# Altium project LHCbit.PrjPcb
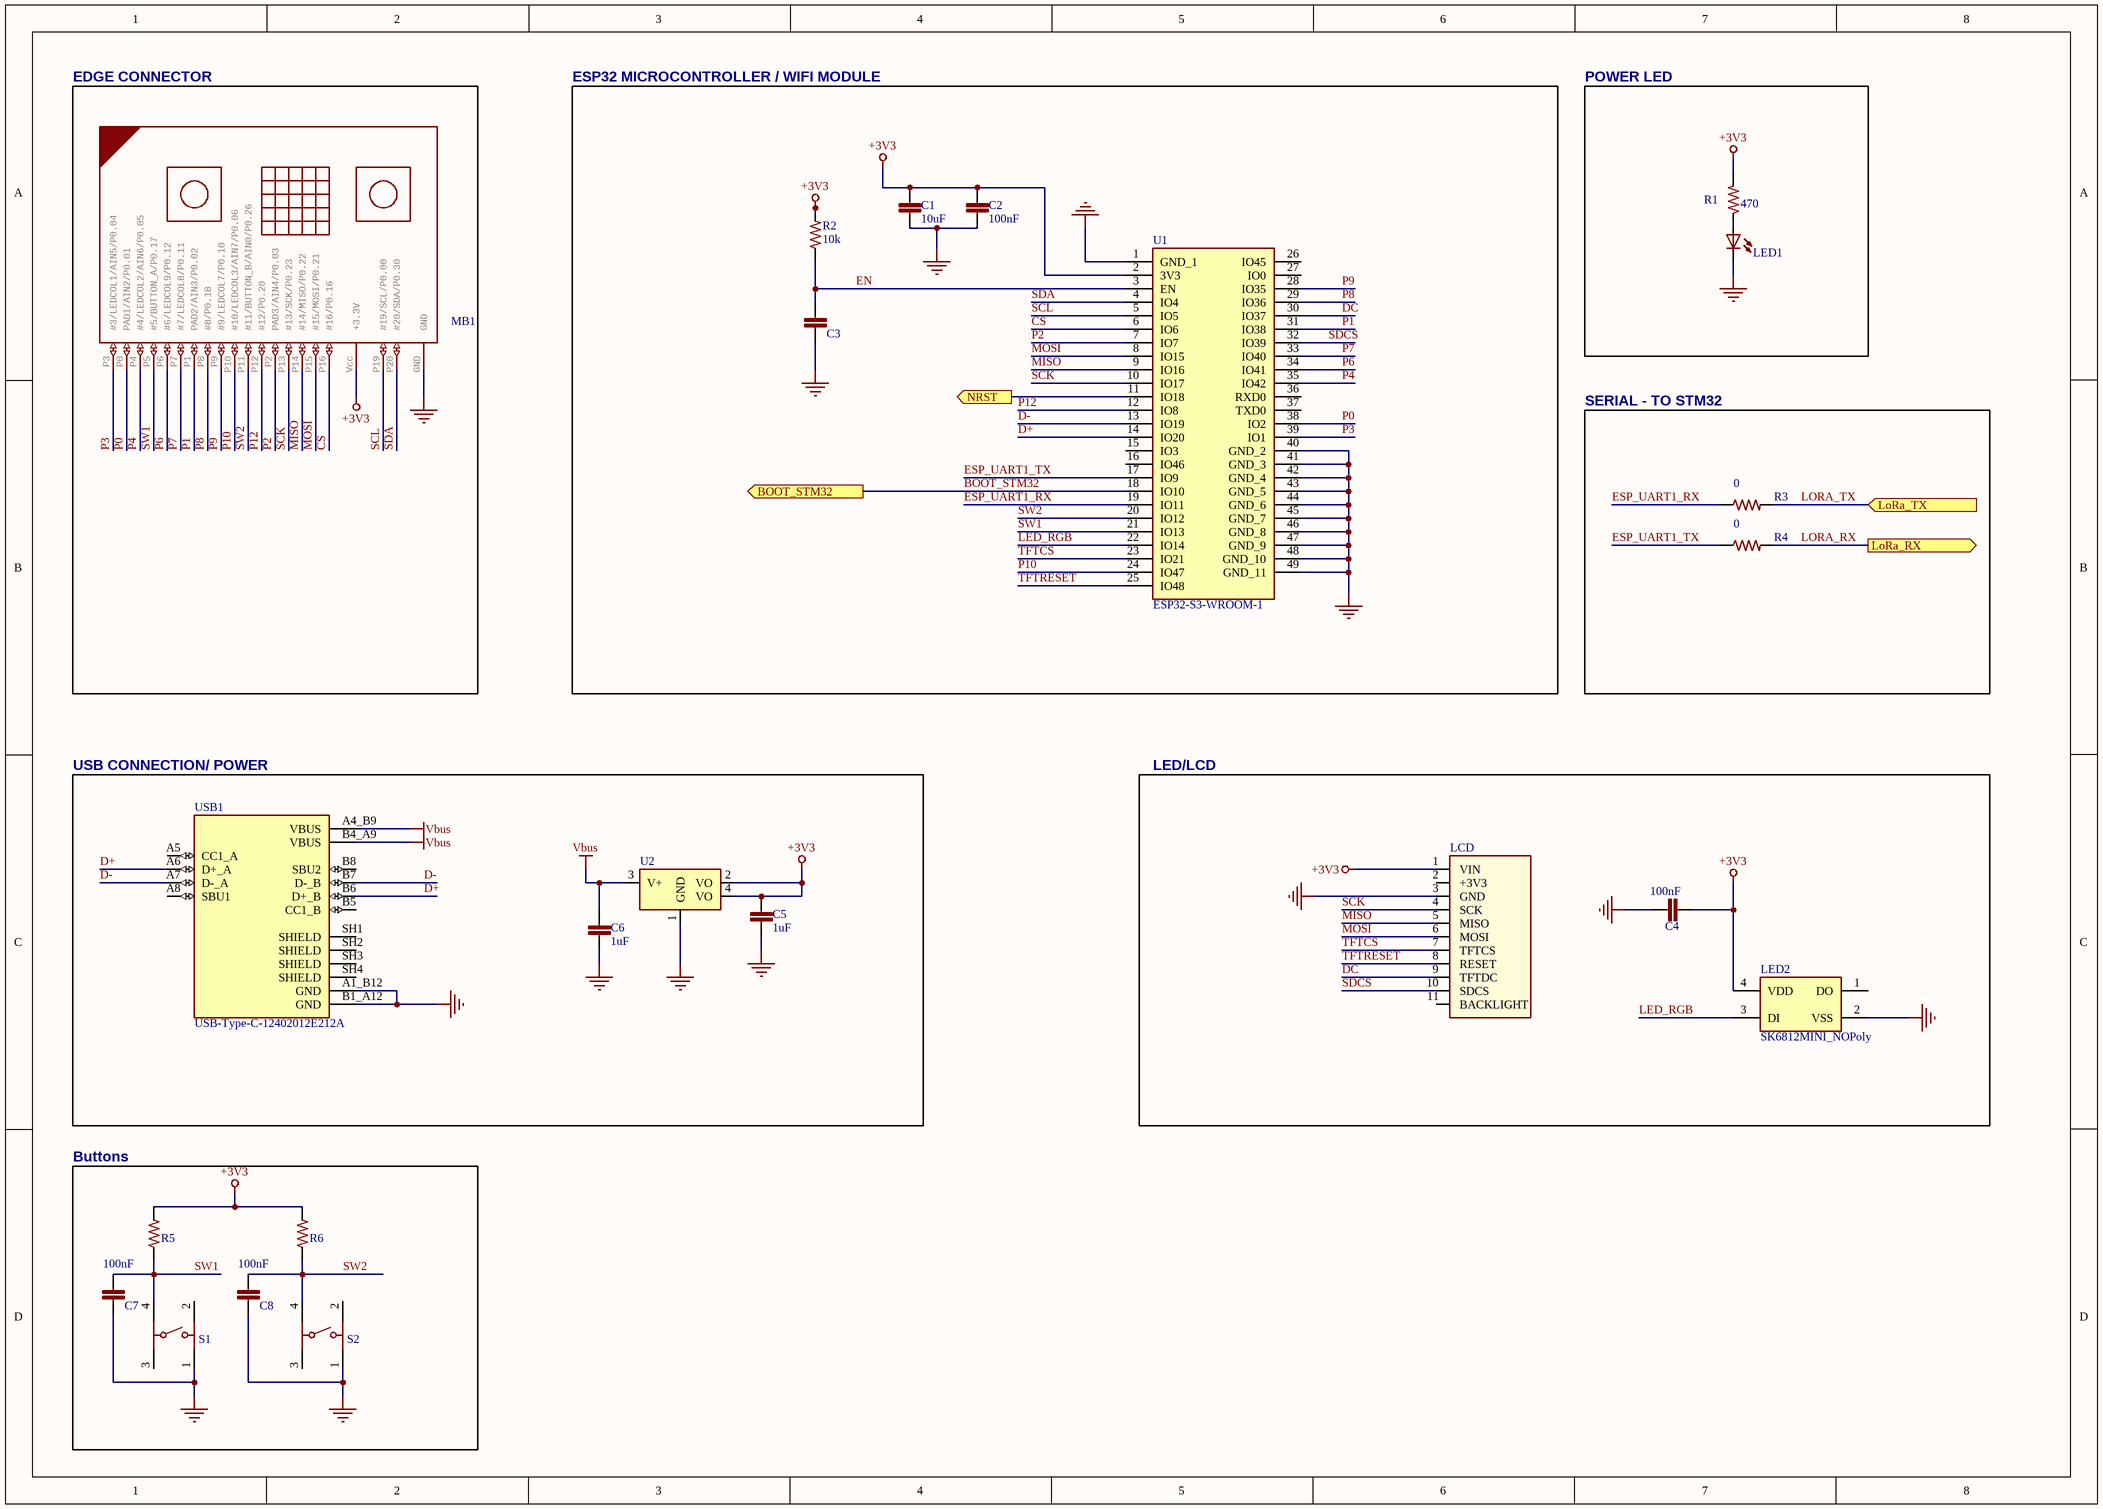
[diagram p0: ESP32_LHCbit.SchDoc]
<SheetTotal>: 2; <Revision>: 1.0; <ProjectName>: LHCbit; <Author>: Leandro Pereira / Thiago Roque/Gustavo
2 sheets, 50 parts. Net scope: flat (ports and power ports of the same name join across sheets).
Board file: LHCbit.PcbDoc
Sheets:
  ESP32_LHCbit.SchDoc
  STM32WL_LHCbit.SchDoc

## Sheet ESP32_LHCbit.SchDoc
size A3; SheetNumber: 1

### Parts
C1  value 10uF  [C0603]  (hidden comment: C-EUC0603)
C2  value 100nF  [C0603]  (hidden comment: C-EUC0603)
C3  C-EUC0402  [C0402]  (value not drawn)
C4  value 100nF  [C0402]  (hidden comment: C-EUC0402)
C5  value 1uF  [C0603]  (hidden comment: C-EUC0603)
C6  value 1uF  [C0603]  (hidden comment: C-EUC0603)
C7  value 100nF  [C0402]  (hidden comment: C-EUC0402)
C8  value 100nF  [C0402]  (hidden comment: C-EUC0402)
LCD  Adafruit 0.96"  TFT LCD  [ADafruit 0.96 Display]  (value not drawn)
LED1  (no value)  [CHIPLED_0805]
LED2  SK6812MINI_NOPoly  [WS2812BMINI_no_poly]
MB1  MICRO:BIT_EDGE  [MICROBIT_EDGE]  (value not drawn)  (no BOM)
R1  value 470  [R0603]  (hidden comment: R-US_R0603)
R2  value 10k  [R0402]  (hidden comment: R-US_R0402)
R3  value 0  [R0402]  (hidden comment: R-US_R0402)
R4  value 0  [R0402]  (hidden comment: R-US_R0402)
R5  R-US_R0402  [R0402]  (value not drawn)
R6  R-US_R0402  [R0402]  (value not drawn)
S1  DTSM-6  [4301x20438x6_6x6x4.3_DTSM-6]  (value not drawn)
S2  DTSM-6  [4301x20438x6_6x6x4.3_DTSM-6]  (value not drawn)
U1  ESP32-S3-WROOM-1  [ESP32S3WROOM1N16R2]
U2  NCP1117LP  [SOT223]  (value not drawn)
USB1  USB-Type-C-12402012E212A  [AMPHENOL_12402012E212A]

### Blocks framed on the sheet
EDGE CONNECTOR: MB1
ESP32 MICROCONTROLLER / WIFI MODULE: C1-C3 R2 U1
POWER LED: LED1 R1
SERIAL - TO STM32: R3 R4
USB CONNECTION/ POWER: C5 C6 U2 USB1
LED/LCD: C4 LCD LED2
Buttons: C7 C8 R5 R6 S1 S2

### Ports
BOOT_STM32 (out), LoRa_RX (out), LoRa_TX (in), NRST (out)

### Nets
+3V3: C1.1 C2.1 C4.2 C5.1 LCD.1(VIN) LED2.4(VDD) MB1.Vcc(+3.3V) R1.2 R2.2 R5.2 R6.2 U1.2(3V3) U2.2(VO) U2.4(VO)  [project net VBAT]
GND: C1.2 C2.2 C3.2 C4.1 C5.2 C6.2 C7.2 C8.2 LCD.3(GND) LED1.C LED2.2(VSS) MB1.GND S1.1 S2.1 U1.1(GND_1) U1.40(GND_2) U1.41(GND_3) U1.42(GND_4) U1.43(GND_5) U1.44(GND_6) U1.45(GND_7) U1.46(GND_8) U1.47(GND_9) U1.48(GND_10) U1.49(GND_11) U2.1(GND) USB1.A1_B12(GND) USB1.B1_A12(GND)
Vbus: C6.1 U2.3(V+) USB1.A4_B9(VBUS) USB1.B4_A9(VBUS)
BOOT_STM32: U1.18(IO10) ; port BOOT_STM32
CS: MB1.P16(#16/P0.16) U1.6(IO6)
D+: U1.14(IO20) USB1.A6(D+_A) USB1.B6(D+_B)
D-: U1.13(IO19) USB1.A7(D-_A) USB1.B7(D-_B)
DC: LCD.9(TFTDC) U1.30(IO37)
EN: C3.1 R2.1 U1.3(EN)
ESP_UART1_RX: R3.1 U1.19(IO11)
ESP_UART1_TX: R4.1 U1.17(IO9)
LED_RGB: LED2.3(DI) U1.22(IO14)
LORA_RX: R4.2 ; port LoRa_RX
LORA_TX: R3.2 ; port LoRa_TX
MISO: LCD.5(MISO) MB1.P14(#14/MISO/P0.22) U1.9(IO16)
MOSI: LCD.6(MOSI) MB1.P15(#15/MOSI/P0.21) U1.8(IO15)
P0: MB1.P0(PAD1/AIN2/P0.01) U1.38(IO2)
P1: MB1.P1(PAD2/AIN3/P0.02) U1.31(IO38)
P2: MB1.P2(PAD3/AIN4/P0.03) U1.7(IO7)
P3: MB1.P3(#3/LEDCOL1/AIN5/P0.04) U1.39(IO1)
P4: MB1.P4(#4/LEDCOL2/AIN6/P0.05) U1.35(IO42)
P6: MB1.P6(#6/LEDCOL9/P0.12) U1.34(IO41)
P7: MB1.P7(#7/LEDCOL8/P0.11) U1.33(IO40)
P8: MB1.P8(#8/P0.18) U1.29(IO36)
P9: MB1.P9(#9/LEDCOL7/P0.10) U1.28(IO35)
P10: MB1.P10(#10/LEDCOL3/AIN7/P0.06) U1.24(IO47)
P12: MB1.P12(#12/P0.20) U1.12(IO8)
SCK: LCD.4(SCK) MB1.P13(#13/SCK/P0.23) U1.10(IO17)
SCL: MB1.P19(#19/SCL/P0.00) U1.5(IO5)
SDA: MB1.P20(#20/SDA/P0.30) U1.4(IO4)
SDCS: LCD.10(SDCS) U1.32(IO39)
SW1: C7.1 MB1.P5(#5/BUTTON_A/P0.17) R5.1 S1.4 U1.21(IO13)
SW2: C8.1 MB1.P11(#11/BUTTON_B/AIN0/P0.26) R6.1 S2.4 U1.20(IO12)
TFTCS: LCD.7(TFTCS) U1.23(IO21)
TFTRESET: LCD.8(RESET) U1.25(IO48)
NetC18_1: U1.11(IO18) ; port NRST
NetLED1_A: LED1.A R1.1

Not connected (* = marked no-connect by the designer): LCD 2(+3V3) 11(BACKLIGHT); LED2 1(DO); S1 2 3; S2 2 3; U1 15(IO3) 16(IO46) 26(IO45) 27(IO0) 36(RXD0) 37(TXD0); USB1 A5(CC1_A) A8(SBU1) B5(CC1_B) B8(SBU2) SH1(SHIELD) SH2(SHIELD) SH3(SHIELD) SH4(SHIELD)

### Library data of the parts
C1 = C-EUC0603: Part Number: CL10A106KP8NNNC; Vendor: Samsung; Família: Capacitor
C2 = C-EUC0603: Part Number: CC0603KRX7R9BB104; Vendor: YAGEO; Família: Capacitor
C3 = C-EUC0402: Part Number: C0402C104K8; Value: 100nF; Vendor: KEMET; Família: Capacitor
C4 C7 C8 = C-EUC0402: Part Number: C0402C104K8; Vendor: KEMET; Família: Capacitor
C5 C6 = C-EUC0603: Part Number: CL10A105KO8NNNC; Vendor: Samsung; Família: Capacitor
LED1 = LEDCHIPLED_0805: Part Number: AP2012EC; Vendor: Kingbright; Família: LED
LED2 = SK6812MINI_NOPoly: SMD RGB (WS2812/SK6812MINI) 3535; Família: LED; Vendor: *; Value: *; Part Number: SK6812MINI
R1 = R-US_R0603: Part Number: RC0603FR-07470RL; Vendor: Yageo
R2 = R-US_R0402: Part Number: RC0402FR-0710KL; Vendor: YAGEO; Família: Resistor
R3 R4 = R-US_R0402: Part Number: PA0402-R-070RL; Vendor: YAGEO; Família: Resistor
R5 R6 = R-US_R0402: Part Number: RC0402FR-0710KL; Value: 10k; Vendor: YAGEO; Família: Resistor
S1 S2 = DTSM-6: WS-TASV 6x6mm Tact Switch, SMD version; Vendor: Wurth Elektronik; Família: Switches; Part Number: DTSM-6
U1 = ESP32-S3-WROOM-1: Integrated Circuit; Part Number: ESP32-S3-WROOM-1-N16R2; Vendor: Espressif; Família: IC
U2 = NCP1117LP: Part Number: TLV1117LV33DCYR; Vendor: Texas Instruments
USB1 = USB-Type-C-12402012E212A: USB2.0, Type C; Part Number: TYPEC-304-ACP16; Família: Connector; Vendor: XUNPU; Value: *

## Sheet STM32WL_LHCbit.SchDoc: Prototipo Medidor Sem Fio
size A3; SheetNumber: 3
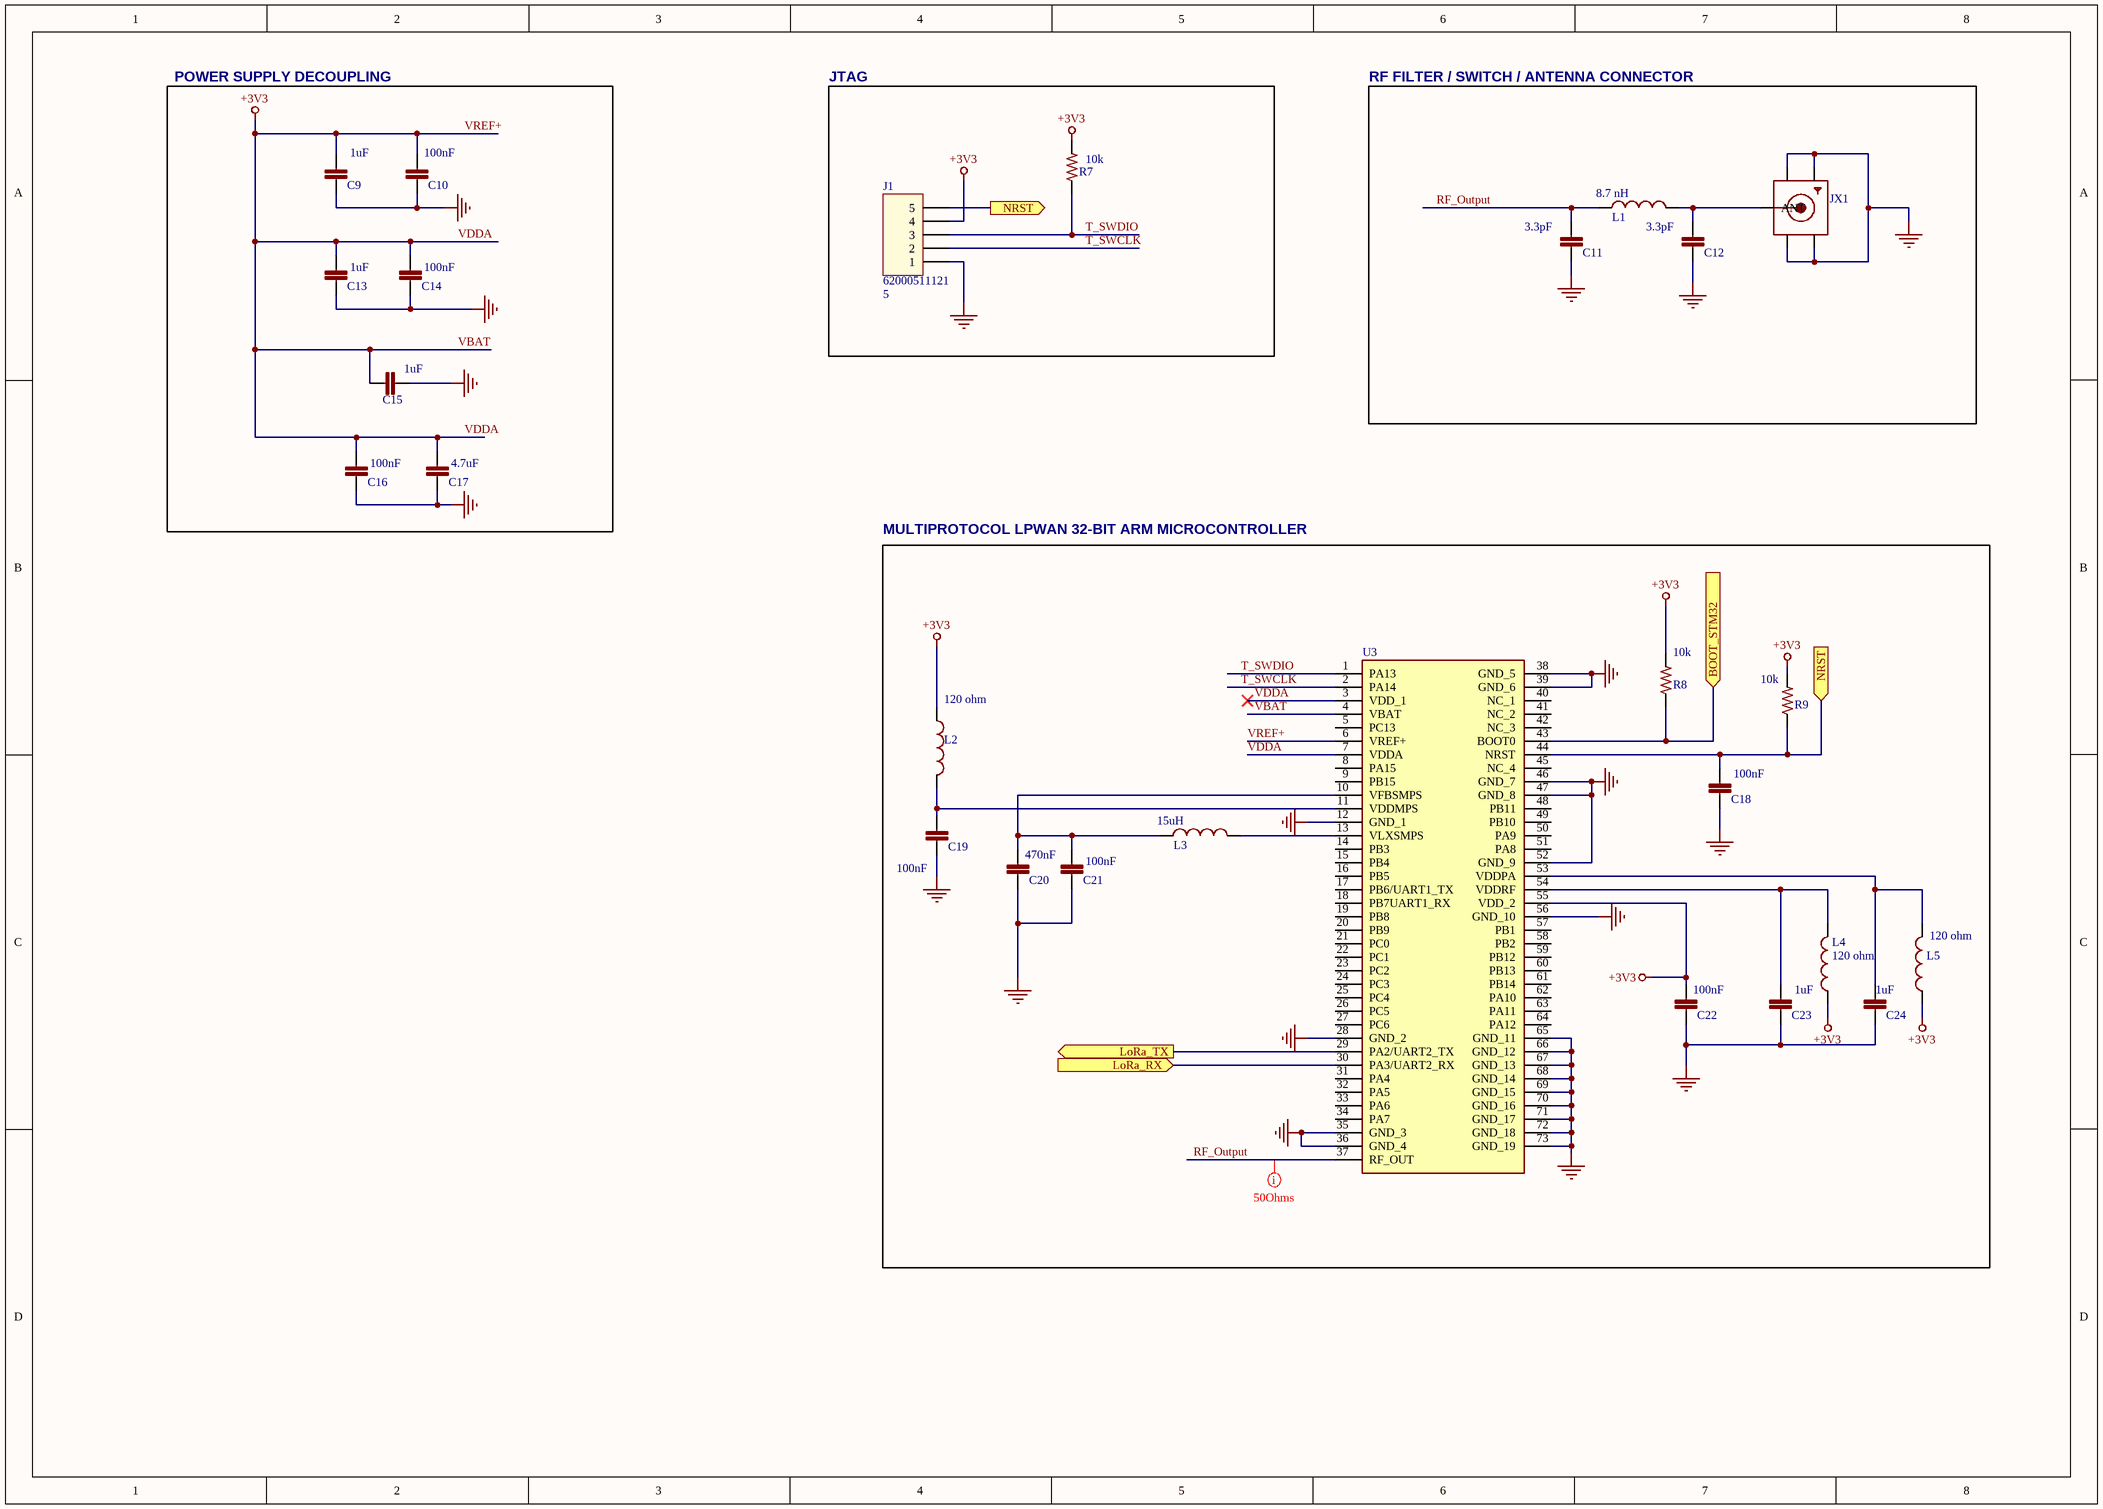
[diagram p1: STM32WL_LHCbit.SchDoc]

### Parts
C9  value 1uF  [C0402]  (hidden comment: C-EUC0402)
C10  value 100nF  [C0402]  (hidden comment: C-EUC0402)
C11  value 3.3pF  [C0402]  (hidden comment: C-EUC0402)  (no BOM)
C12  value 3.3pF  [C0402]  (hidden comment: C-EUC0402)  (no BOM)
C13  value 1uF  [C0402]  (hidden comment: C-EUC0402)
C14  value 100nF  [C0402]  (hidden comment: C-EUC0402)
C15  value 1uF  [C0402]  (hidden comment: C-EUC0402)
C16  value 100nF  [C0402]  (hidden comment: C-EUC0402)
C17  value 4.7uF  [C0402]  (hidden comment: C-EUC0402)
C18  value 100nF  [C0402]  (hidden comment: C-EUC0402)
C19  value 100nF  [C0402]  (hidden comment: C-EUC0402)
C20  value 470nF  [C0402]  (hidden comment: C-EUC0402)
C21  value 100nF  [C0402]  (hidden comment: C-EUC0402)
C22  value 100nF  [C0402]  (hidden comment: C-EUC0402)
C23  value 1uF  [C0402]  (hidden comment: C-EUC0402)
C24  value 1uF  [C0402]  (hidden comment: C-EUC0402)
J1  62000511121  value 5  [62000511121]  (no BOM)
JX1  SMACONNECTOR_EDGE_UFL  [SMA_EDGELAUNCH_UFL]  (value not drawn)
L1  value 8.7 nH  [L0402 - rounded]  (hidden comment: Ferrite bead 0402)
L2  value 120 ohm  [L0603]  (hidden comment: Ferrite bead 0603)
L3  value 15uH  [L0805]
L4  value 120 ohm  [L0603]  (hidden comment: Ferrite bead 0603)
L5  value 120 ohm  [L0603]  (hidden comment: Ferrite bead 0603)
R7  value 10k  [R0402]  (hidden comment: R-US_R0402)
R8  value 10k  [R0402]  (hidden comment: R-US_R0402)
R9  value 10k  [R0402]  (hidden comment: R-US_R0402)
U3  RAK3172-SiP  [RAK3172SiP]  (value not drawn)

### Blocks framed on the sheet
POWER SUPPLY DECOUPLING: C9 C10 C13-C17
JTAG: J1 R7
RF FILTER / SWITCH / ANTENNA CONNECTOR: C11 C12 JX1 L1
MULTIPROTOCOL LPWAN 32-BIT ARM MICROCONTROLLER: C18-C24 L2-L5 R8 R9 U3

### Ports
BOOT_STM32 (in), LoRa_RX (in), LoRa_TX (out), NRST (in), NRST (out)

### Nets
GND: C9.2 C10.2 C11.1 C12.1 C13.2 C14.2 C15.2 C16.2 C17.2 C18.2 C19.2 C20.2 C21.2 C22.2 C23.2 C24.2 J1.1 JX1.GND@1(GND1) JX1.GND@2(GND2) JX1.GND@3(GND3) JX1.GND@4(GND4) U3.12(GND_1) U3.28(GND_2) U3.35(GND_3) U3.36(GND_4) U3.38(GND_5) U3.39(GND_6) U3.46(GND_7) U3.47(GND_8) U3.52(GND_9) U3.56(GND_10) U3.65(GND_11) U3.66(GND_12) U3.67(GND_13) U3.68(GND_14) U3.69(GND_15) U3.70(GND_16) U3.71(GND_17) U3.72(GND_18) U3.73(GND_19)
VBAT: C9.1 C10.1 C13.1 C14.1 C15.1 C16.1 C17.1 C22.1 J1.4 L2.1 L4.1 L5.1 R7.2 R8.2 R9.2 U3.3(VDD_1) U3.4(VBAT) U3.6(VREF+) U3.7(VDDA) U3.55(VDD_2)  [also labelled +3V3, VDDA, VREF+]
BOOT_STM32: R8.1 U3.43(BOOT0) ; port BOOT_STM32
LORA_RX: U3.30(PA3/UART2_RX) ; port LoRa_RX
LORA_TX: U3.29(PA2/UART2_TX) ; port LoRa_TX
RF_Output: C11.2 L1.1 U3.37(RF_OUT)
T_SWCLK: J1.2 U3.2(PA14)
T_SWDIO: J1.3 R7.1 U3.1(PA13)
NetC12_2: C12.2 JX1.P(ANT) L1.2
NetC18_1: C18.1 J1.5 R9.1 U3.44(NRST) ; port NRST
NetC19_1: C19.1 L2.2 U3.11(VDDMPS)
NetC20_1: C20.1 C21.1 L3.1 U3.10(VFBSMPS)
NetC23_1: C23.1 L4.2 U3.54(VDDRF)
NetC24_1: C24.1 L5.2 U3.53(VDDPA)
NetL3_2: L3.2 U3.13(VLXSMPS)

Not connected (* = marked no-connect by the designer): U3 5(PC13) 8(PA15) 9(PB15) 14(PB3) 15(PB4) 16(PB5) 17(PB6/UART1_TX) 18(PB7UART1_RX) 19(PB8) 20(PB9) 21(PC0) 22(PC1) 23(PC2) 24(PC3) 25(PC4) 26(PC5) 27(PC6) 31(PA4) 32(PA5) 33(PA6) 34(PA7) 40(NC_1) 41(NC_2) 42(NC_3) 45(NC_4) 48(PB11) 49(PB10) 50(PA9) 51(PA8) 57(PB1) 58(PB2) 59(PB12) 60(PB13) 61(PB14) 62(PA10) 63(PA11) 64(PA12)

### Layout directives
net class 50Ohms: RF_Output

### Library data of the parts
C9 C13 C15 C23 C24 = C-EUC0402: Part Number: CL05A105KA5NQNC; Vendor: Samsung; Família: Capacitor
C10 C14 C16 C18 C19 C21 C22 = C-EUC0402: as C4 on sheet ESP32_LHCbit
C11 C12 = C-EUC0402: Part Number: GRM1555C1H3R3WA01D; Vendor: Murata; Família: Capacitor
C17 = C-EUC0402: Part Number: CL05A475MQ5NRNC; Vendor: Samsung; Família: Capacitor
C20 = C-EUC0402: Part Number: GRM155R61H474KE11D; Vendor: Murata; Família: Capacitor
J1 = 62000511121: WR-PHD 2.00 mm THT Pin Header, 6p; Vendor: Wurth Elektronik; Família: Connector; Part Number: 62000511121
JX1 = SMACONNECTOR_EDGE_UFL: Part Number: SMA-J-P-H-ST-EM1; Vendor: SAMTECH; Família: Connector
L1 = L-US0402: Part Number: LQW15AN8N7G00D; Vendor: Murata; Família: Inductor
L2 L4 L5 = L-US0603: Part Number: YI160808U121-2R5T; Vendor: YJYCOIN; Família: Inductor
L3 = L-US0805: Part Number: MLZ2012M150WTD25; Vendor: TDK; Família: Inductor
R7-R9 = R-US_R0402: as R2 on sheet ESP32_LHCbit
U3 = RAK3172-SiP: Integrated Circuit; Part Number: RAK3172-SIP-9-SM-NI; Família: IC; Vendor: RAK

## Nets that join several sheets
GND: ESP32_LHCbit (28 pins), STM32WL_LHCbit (40 pins)
VBAT: ESP32_LHCbit (14 pins), STM32WL_LHCbit (20 pins)
BOOT_STM32: ESP32_LHCbit (U1.18), STM32WL_LHCbit (R8.1 U3.43)
LORA_RX: ESP32_LHCbit (R4.2), STM32WL_LHCbit (U3.30)
LORA_TX: ESP32_LHCbit (R3.2), STM32WL_LHCbit (U3.29)
NetC18_1: ESP32_LHCbit (U1.11), STM32WL_LHCbit (C18.1 J1.5 R9.1 U3.44)